# EAGLE design TPS54340 PS and Load Rev1 (EAGLE 9.3.0)
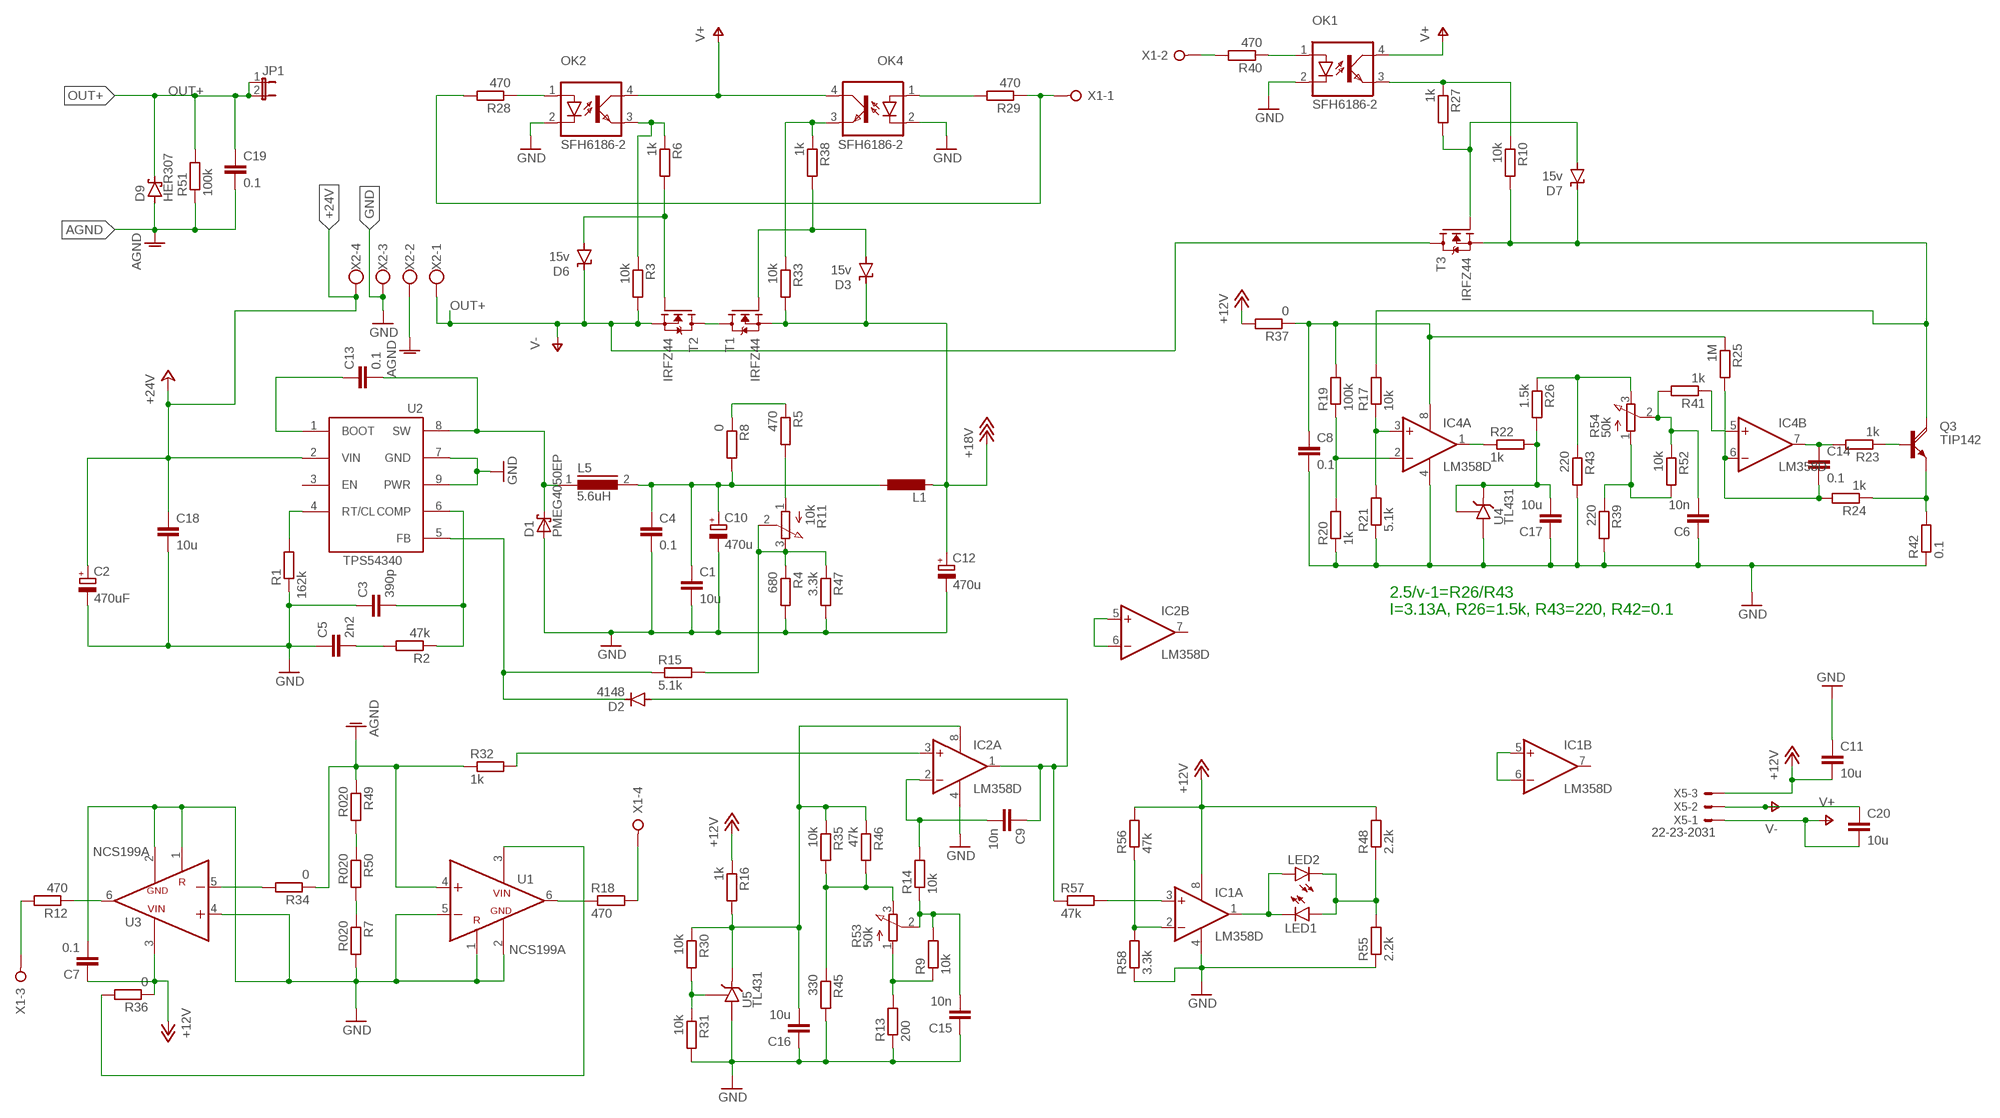
[diagram p0: schematic, sheet 1]

## Parts
C1  10u  C-EUC1210  [C1210]
C2  470uF  CPOL-EUE5-10.5  [E5-10,5]
C3  390p  C-EUC0603K  [C0603K]
C4  0.1  C-EUC1206  [C1206]
C5  2n2  C-EUC0603K  [C0603K]
C6  10n  C-EUC0603K  [C0603K]
C7  0.1  C-EUC0603K  [C0603K]
C8  0.1  C-EUC1206  [C1206]
C9  10n  C-EUC0603K  [C0603K]
C10  470u  CPOL-EUE5-10.5  [E5-10,5]
C11  10u  C-EUC1206  [C1206]
C12  470u  CPOL-EUE5-10.5  [E5-10,5]
C13  0.1  C-EU102-043X133  [C102-043X133]
C14  0.1  C-EUC1206  [C1206]
C15  10n  C-EUC0603K  [C0603K]
C16  10u  C-EUC0603K  [C0603K]
C17  10u  C-EUC0603K  [C0603K]
C18  10u  C-EUC1210  [C1210]
C19  0.1  C-EU150-054X183  [C150-054X183]
C20  10u  C-EUC1206  [C1206]
D1  PMEG4050EP  [SOD128]
D2  4148  PMLL41SOD80C  [SOD80C]
D3  15v  SUPPRESSOR-SMBJ  [SMBJ]
D6  15v  SUPPRESSOR-SMBJ  [SMBJ]
D7  15v  SUPPRESSOR-SMBJ  [SMBJ]
D9  HER307  15KEXX  [CB429-17]
IC1  LM358D  [SO08]
IC2  LM358D  [SO08]
IC4  LM358D  [SO08]
JP1  JP1E  [JP1]
L1  L-EU0207/5V  [0207/5V]
L5  5.6uH  DR125  [DR125]
LED1  LEDB152  [Q62902-B152]
LED2  LEDB152  [Q62902-B152]
OK1  SFH6186-2  [SMD4-7]
OK2  SFH6186-2  [SMD4-7]
OK4  SFH6186-2  [SMD4-7]
Q3  TIP142  [SOT93]
R1  162k  R-EU_R1206  [R1206]
R2  47k  R-EU_R0603  [R0603]
R3  10k  R-EU_R0603  [R0603]
R4  680  R-EU_R1206  [R1206]
R5  470  R-EU_R1206  [R1206]
R6  1k  R-EU_R0603  [R0603]
R7  R020  R-EU_R1206  [R1206]
R8  0  R-EU_R0603  [R0603]
R9  10k  R-EU_R0603  [R0603]
R10  10k  R-EU_R0603  [R0603]
R11  10k  3RP/1610N  [3RP/1610N]
R12  470  R-EU_R0603  [R0603]
R13  200  R-EU_R0603  [R0603]
R14  10k  R-EU_R1206  [R1206]
R15  5.1k  R-EU_R0603  [R0603]
R16  1k  R-EU_R0603  [R0603]
R17  10k  R-EU_R1206  [R1206]
R18  470  R-EU_R0603  [R0603]
R19  100k  R-EU_R1206  [R1206]
R20  1k  R-EU_R1206  [R1206]
R21  5.1k  R-EU_R1206  [R1206]
R22  1k  R-EU_R0603  [R0603]
R23  1k  R-EU_R1206  [R1206]
R24  1k  R-EU_R1206  [R1206]
R25  1M  R-EU_R1206  [R1206]
R26  1.5k  R-EU_R0603  [R0603]
R27  1k  R-EU_R0603  [R0603]
R28  470  R-EU_R0603  [R0603]
R29  470  R-EU_R0603  [R0603]
R30  10k  R-EU_R0603  [R0603]
R31  10k  R-EU_R0603  [R0603]
R32  1k  R-EU_R1206  [R1206]
R33  10k  R-EU_R0603  [R0603]
R34  0  R-EU_R1206  [R1206]
R35  10k  R-EU_R0603  [R0603]
R36  0  R-EU_R1206  [R1206]
R37  0  R-EU_R1206  [R1206]
R38  1k  R-EU_R0603  [R0603]
R39  220  R-EU_R0603  [R0603]
R40  470  R-EU_R0603  [R0603]
R41  1k  R-EU_R1206  [R1206]
R42  0.1  R-EU_0414/15  [0414/15]
R43  220  R-EU_R0603  [R0603]
R45  330  R-EU_R0603  [R0603]
R46  47k  R-EU_R0603  [R0603]
R47  3.3k  R-EU_R1206  [R1206]
R48  2.2k  R-EU_R0603  [R0603]
R49  R020  R-EU_R1206  [R1206]
R50  R020  R-EU_R1206  [R1206]
R51  100k  R-EU_0207/15  [0207/15]
R52  10k  R-EU_R0603  [R0603]
R53  50k  3RP/1610N  [3RP/1610N]
R54  50k  3RP/1610N  [3RP/1610N]
R55  2.2k  R-EU_R0603  [R0603]
R56  47k  R-EU_R0603  [R0603]
R57  47k  R-EU_R0603  [R0603]
R58  3.3k  R-EU_R0603  [R0603]
T1  IRFZ44  MOSFET-N-DPAK  [DPAK_TO252]
T2  IRFZ44  MOSFET-N-DPAK  [DPAK_TO252]
T3  IRFZ44  MOSFET-N-DPAK  [DPAK_TO252]
U1  NCS199A  [SOT363]
U2  TPS54340  TPS54340SO8  [HSOP]
U3  NCS199A  [SOT363]
U4  TL431  [SOT23]
U5  TL431  [SOT23]
X1  W237-04P  [W237-4P]
X2  W237-4  [W237-4]
X5  22-23-2031  [22-23-2031]

## Nets
+12V: C7.1 C11.2 IC1.8(P:V+) R16.1 R36.1 R37.2 R48.2 R56.2 U3.3(VCC) X5.3
+18V: C12.+ D3.C L1.2 R33.2 T1.3(S)
+24V: C2.+ C18.1 U2.2(VIN) X2.4
AGND: C19.2 D9.A R32.1 R34.1 R49.1 R51.1 U1.4(IN+) X2.2
GND: C1.2 C2.- C3.1 C4.2 C5.1 C6.1 C7.2 C8.2 C10.- C11.1 C12.- C15.1 C16.1 C17.1 C18.2 D1.2(A) IC1.4(P:V-) IC2.4(P:V-) IC4.4(P:V-) OK1.2(C) OK2.2(C) OK4.2(C) R1.1 R4.2 R7.2 R13.1 R20.1 R21.1 R31.2 R39.2 R42.1 R43.2 R45.2 R47.2 R55.1 R58.1 U1.1(REF) U1.2(GND) U1.5(IN-) U2.7(GND) U2.9(PWR) U3.1(REF) U3.2(GND) U3.4(IN+) U4.3(A) U5.3(A) X2.3
N$1: R1.2 U2.4(RT/CL)
N$2: C5.2 R2.2
N$3: C3.2 R2.1 U2.6(COMP)
N$4: R5.2 R11.1(A)
N$5: D6.A R6.2 T2.1(G)
N$6: IC2.3(A:+IN) R32.2
N$7: R4.1 R11.2(S) R11.3(E) R15.2 R47.1
N$8: C16.2 IC2.8(P:V+) R16.2 R30.1 R35.1 R46.1 U5.1(C)
N$10: OK2.3(EMIT) R3.1 R6.1
N$12: D3.A R38.2 T1.1(G)
N$13: C13.1 U2.1(BOOT)
N$14: C13.2 D1.1(K) L5.1 U2.8(SW)
N$15: R12.1 U3.6(OUT)
N$16: C9.2 IC2.2(A:-IN) R14.2
N$17: R30.2 R31.1 U5.2(R)
N$18: C9.1 D2.A IC2.1(A:OUT) R57.1
N$19: C15.2 R9.2 R14.1 R53.2(S)
N$20: R34.2 U3.5(IN-)
N$21: D2.C R15.1 U2.5(FB)
N$22: R18.1 U1.6(OUT)
N$23: T1.2(D) T2.2(D)
N$24: IC1.1(A:OUT) LED1.K(C) LED2.A
N$25: C1.1 C4.1 C10.+ L1.1 L5.2 R8.2
N$26: Q3.B R23.1
N$27: OK1.1(A) R40.1
N$28: C14.2 IC4.6(B:-IN) R24.2 R25.2
N$30: R26.1 R43.1 R54.3(E)
N$31: D7.C Q3.C R10.2 R17.2 T3.3(S)
N$32: OK1.3(EMIT) R10.1 R27.1
N$34: LED1.A LED2.K(C) R48.1 R55.2
N$35: R35.2 R45.1 R46.2 R53.3(E)
N$36: IC4.5(B:+IN) R41.1
N$37: IC1.2(A:-IN) R56.1 R58.2
N$38: R36.2 U1.3(VCC)
N$39: R18.2 X1.4
N$40: R12.2 X1.3
N$41: D7.A R27.2 T3.1(G)
N$42: R39.1 R52.2 R54.1(A)
N$43: C8.1 IC4.8(P:V+) R19.2 R25.1 R37.1
N$44: R40.2 X1.2
N$45: R9.1 R13.2 R53.1(A)
N$46: R49.2 R50.1
N$47: IC2.5(B:+IN) IC2.6(B:-IN)
N$48: IC1.3(A:+IN) R57.2
N$49: IC1.5(B:+IN) IC1.6(B:-IN)
N$52: R7.1 R50.2
N$61: OK4.3(EMIT) R33.1 R38.1
N$62: OK4.1(A) R29.2
N$63: R28.2 R29.1 X1.1
N$64: OK2.1(A) R28.1
N$65: C17.2 R22.2 R26.2 U4.1(C) U4.2(R)
N$66: R5.1 R8.1
N$106: Q3.E R24.1 R42.2
N$289: C14.1 IC4.7(B:OUT) R23.2
N$290: C6.2 R41.2 R52.1 R54.2(S)
N$291: IC4.1(A:OUT) R22.1
N$292: IC4.3(A:+IN) R17.1 R21.2
N$294: IC4.2(A:-IN) R19.1 R20.2
OUT+: C19.1 C20.1 D6.C D9.C JP1.1 JP1.2 R3.2 R51.2 T2.3(S) T3.2(D) X2.1 X5.2 ; supply symbol labelled V-
V+: C20.2 OK1.4(COL) OK2.4(COL) OK4.4(COL) X5.1
Unconnected: IC1.7(B:OUT) IC2.7(B:OUT) U2.3(EN)

## Notes on the sheet
- 2.5/v-1=R26/R43
  I=3.13A, R26=1.5k, R43=220, R42=0.1

## Library data of the parts
C1 C3 C5-C7 C9 C13 C15-C19 = rcl:C-EU: CAPACITOR, European symbol; SPICEPREFIX: C
C2 C10 C12 = rcl:CPOL-EU: POLARIZED CAPACITOR, European symbol; SPICEPREFIX: C
C4 C8 C11 C14 C20 = rcl:C-EU: CAPACITOR, European symbol
D1 = NXP_60_26022015:PMEG4050E: 40 V, 5 A low VF MEGA Schottky barrier rectifier Planar Maximum Efficiency General Application (MEGA) Schottky barrier rectifier with an integrated guard ring for stress protection. AAL Eindhoven MK
D2 = diode:PMLL41*: High-speed diodes Source: http://www.semiconductors.philips.com/acrobat_download/datasheets/PMLL4150_2.pdf
D3 D6 D7 = diode:SUPPRESSOR-: Suppressor diode
D9 = diode:15KEXX: DIODE
IC1 IC2 IC4 = linear:LM358: OP AMP also LM158; LM258; LM2904 Source: http://cache.national.com/ds/LM/LM158.pdf
JP1 = jumper:JP1E: JUMPER
L1 = rcl:L-EU: INDUCTOR, European symbol; SPICEPREFIX: L
L5 = inductors:DR125: High Power Density, High Efficiency, Shielded Inductors Source: coiltronics_dr_series.pdf; SPICEPREFIX: L
LED1 LED2 = led:LED: LED OSRAM: - CHIPLED LG R971, LG N971, LY N971, LG Q971, LY Q971, LO R971, LY R971 LH N974, LH R974 LS Q976, LO Q976, LY Q976 LO Q996 - Hyper CHIPLED LW Q18S LB Q993, LB Q99A, LB R99A - SideLED LS A670, LO A670, LY A670, LG A670, LP A670 LB A673, LV A673, LT A673, LW A673 LH A674 LY A675 LS A676, LA A676, LO A676, LY A676, LW A676 LS A679, LY A679, LG A679 - Hyper Micro SIDELED® LS Y876, LA Y876, LO Y876, LY Y876 LT Y87S - SmartLED LW L88C, LW L88S LB L89C, LB L89S, LG L890 LS L89K, LO L89K, LY L89K LS L896, LA L896, LO L896, LY L896 - TOPLED LS T670, LO T670, LY T670, LG T670, LP T670 LSG T670, LSP T670, LSY T670, LOP T670, LYG T670 LG T671, LOG T671, LSG T671 LB T673, LV T673, LT T673, LW T673 LH T674 LS T676, LA T676, LO T676, LY T676, LB T676, LH T676, LSB T676, LW T676 LB T67C, LV T67C, LT T67C, LS T67K, LO T67K, LY T67K, LW E67C LS E67B, LA E67B, LO E67B, LY E67B, LB E67C, LV E67C, LT E67C LW T67C LS T679, LY T679, LG T679 LS T770, LO T770, LY T770, LG T770, LP T770 LB T773, LV T773, LT T773, LW T773 LH T774 LS E675, LA E675, LY E675, LS T675 LS T776, LA T776, LO T776, LY T776, LB T776 LHGB T686 LT T68C, LB T68C - Hyper Mini TOPLED® LB M676 - Mini TOPLED Santana® LG M470 LS M47K, LO M47K, LY M47K Source: http://www.osram.convergy.de LUXEON: - LUMILED® LXK2-PW12-R00, LXK2-PW12-S00, LXK2-PW14-U00, LXK2-PW14-V00 LXK2-PM12-R00, LXK2-PM12-S00, LXK2-PM14-U00 LXK2-PE12-Q00, LXK2-PE12-R00, LXK2-PE12-S00, LXK2-PE14-T00, LXK2-PE14-U00 LXK2-PB12-K00, LXK2-PB12-L00, LXK2-PB12-M00, LXK2-PB14-N00, LXK2-PB14-P00, LXK2-PB14-Q00 LXK2-PR12-L00, LXK2-PR12-M00, LXK2-PR14-Q00, LXK2-PR14-R00 LXK2-PD12-Q00, LXK2-PD12-R00, LXK2-PD12-S00 LXK2-PH12-R00, LXK2-PH12-S00 LXK2-PL12-P00, LXK2-PL12-Q00, LXK2-PL12-R00 Source: www.luxeon.com KINGBRIGHT: KA-3528ASYC Source: www.kingbright.com
OK1 OK2 OK4 = optocoupler:SFH618?*: Optocoupler, Phototransistor Output, Low Input Current Source: Data sheet <http://www.vishay.com/docs/83673/sfh618.pdf>; MF: VISHAY/TELEFUNKEN; MPN: SFH6186-2; OC_FARNELL: 1469583; OC_NEWARK: 58K2210
Q3 = transistor-power:TIP142: NPN DARLINGTON TRANSISTOR
R1 R4 R5 R7 R14 R17 R19-R21 R23-R25 R32 R34 R36 R37 R41 R47 R49 R50 = rcl:R-EU_: RESISTOR, European symbol
R2 R3 R6 R8-R10 R12 R13 R15 R16 R18 R22 R26-R31 R33 R35 R38-R40 R42 R43 R45 R46 R48 R51 R52 R55-R58 = rcl:R-EU_: RESISTOR, European symbol; SPICEPREFIX: R
R11 R53 R54 = pot:3RP/1610N: 16mm Potentiometer one level Source: http://www.alphapotentiometers.net/html/16mm_pot_2.html
T1-T3 = we-transistor:MOSFET-N: N-Channel MOSFET SOT23 N-Chn MOSFET TSM3404, IRLML2502 (Vgs>=+/-20V, Vds<=20V, Id>=3A + Rds<=0.05Ohm @ Vgs=4.5V) BSS138 (Vgs>=+/-20V, Vds<=40V, Id>=0.2A + Rds<=3Ohm @ Vgs=4.5V) SOT223 Low Side Switch with Protection (Infineon) BSP76 (Vin=0...10V, Vds<=42V, Id=1.4A + Rds=0.2Ohm @ Vin=5V) BSP77 (Vin=0...10V, Vds<=42V, Id=2.2A + Rds=0.1Ohm @ Vin=5V) D²Pak Low Side Switch with Protection (Infineon) BTS117TC (Vin=0...10V, Vds<=60V, Id=3.5A + Rds=0.12Ohm @ Vin=5V) BTS133TC (Vin=0...10V, Vds<=60V, Id=7A + Rds=0.06Ohm @ Vin=5V) BTS141TC (Vin=0...10V, Vds<=60V, Id=12A + Rds=0.03Ohm @ Vin=5V) BTS3018TC (Vin=0...10V, Vds<=60V, Id=6A + Rds=0.02Ohm @ Vin=5V)
U1 U3 = ProjectLibrary:NCS199A: NCS199A Current-Shunt Monitor, Voltage Output, Bi-Directional Zero-Drift The LNA is housed in a 6-pin SOT363 plastic SMD package.
U2 = ProjectLibrary:TPS54340: TPS54340 42 V Input, 3.5 A, Step Down DC-DC Converter with Eco-mode™
U4 U5 = 1my:TL431
X1 = con-wago-508:W237-04P: WAGO SREW CLAMP; OC_FARNELL: unknown; OC_NEWARK: unknown
X2 = con-wago-500:W237-4: WAGO SCREW CLAMP; OC_FARNELL: unknown; OC_NEWARK: unknown
X5 = con-molex:22-23-2031: .100" (2.54mm) Center Header - 3 Pin; MF: MOLEX; MPN: 22-23-2031; OC_FARNELL: 1462950; OC_NEWARK: 30C0862

## Board
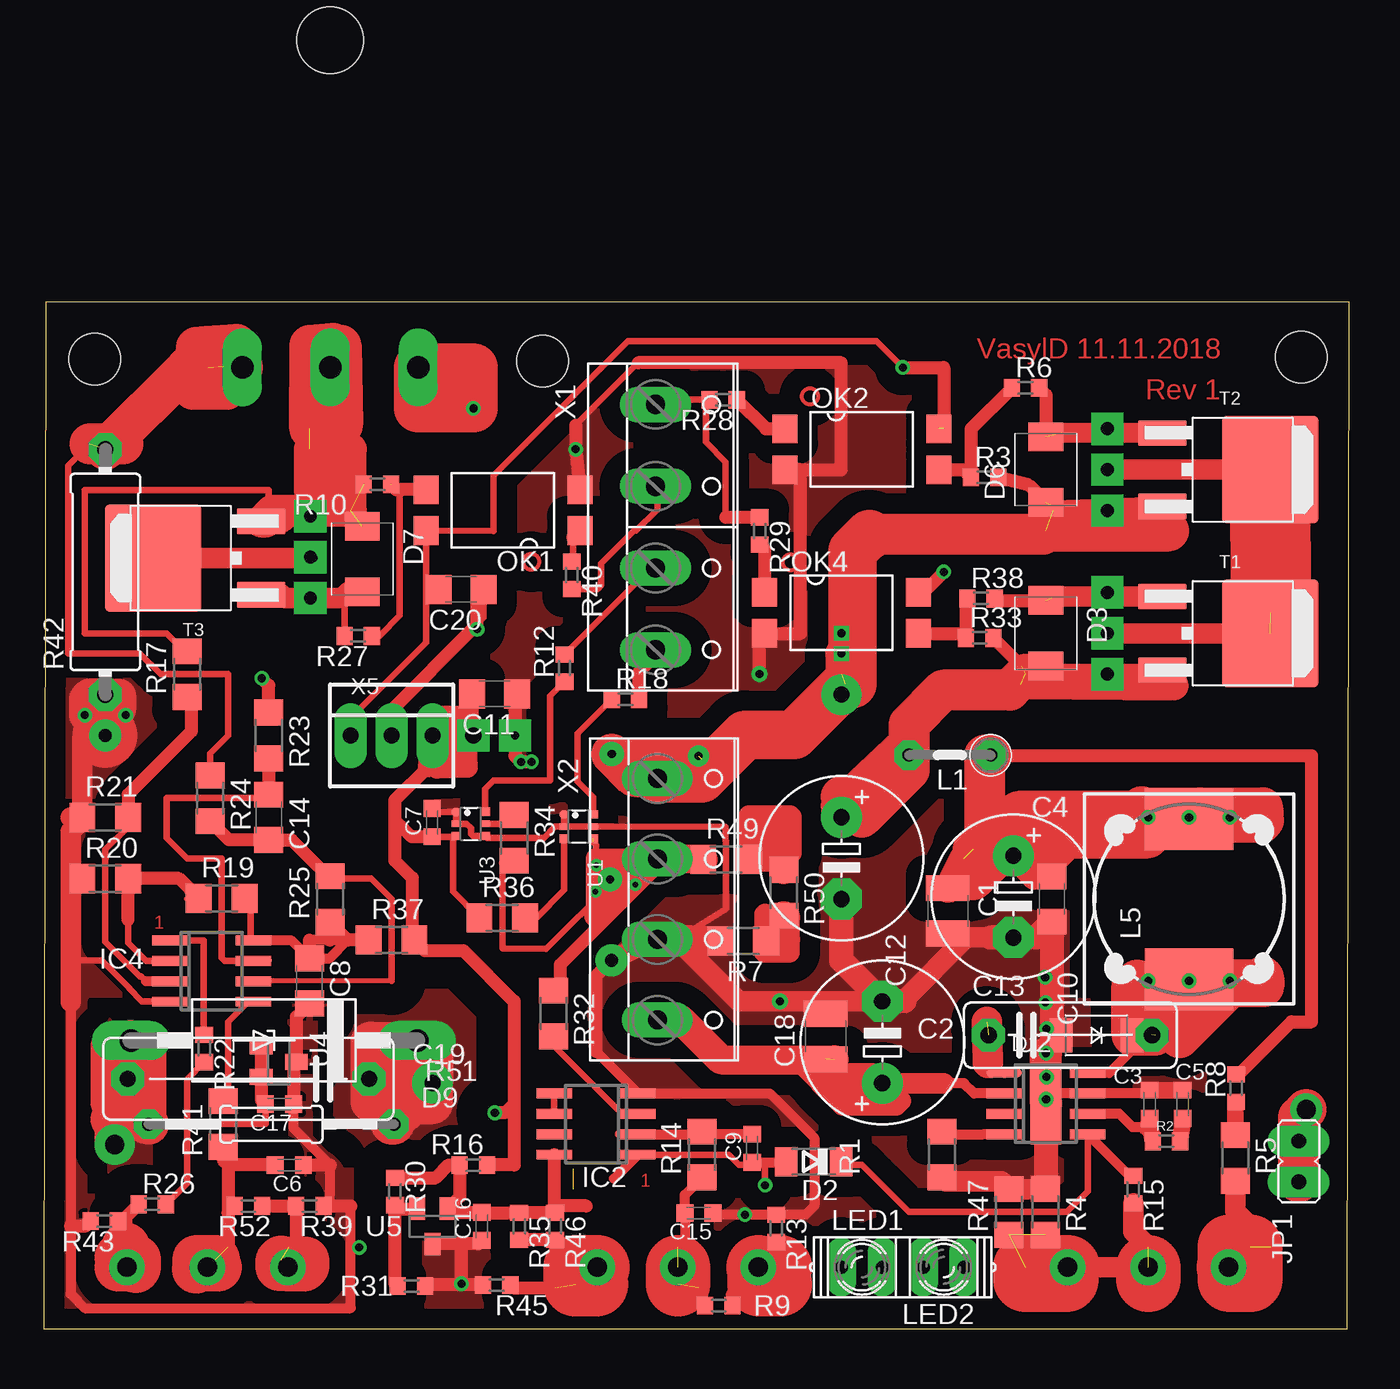
[diagram p1: board, top side]
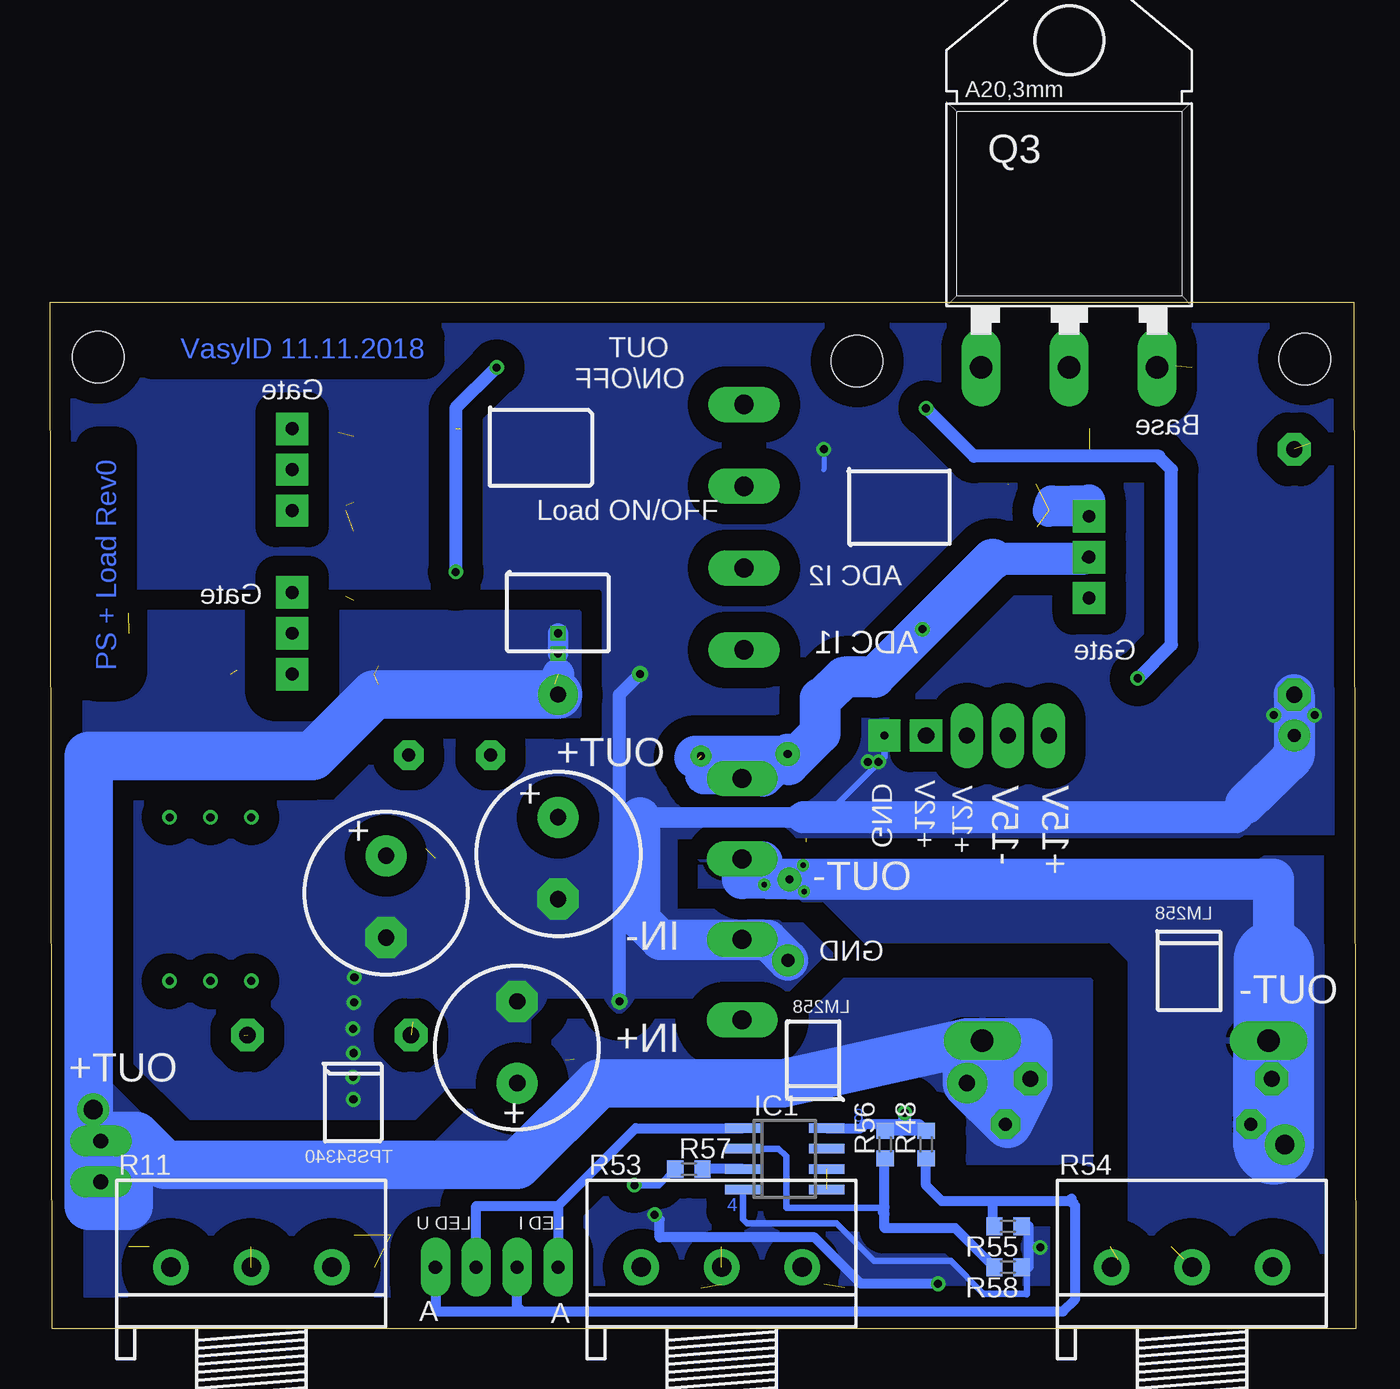
[diagram p2: board, bottom side, seen from below]

Size 81.08 x 63.76 mm. Coordinates in mm from the lower left corner, seen from the top.
Outline: 0,0 80.95,0 81.08,63.76 0.13,63.76 0,0
Copper layers (1*16): Top 0.035mm / dielectric 1.5mm / Bottom 0.035mm
Design rules "Charger for battery (TPS54340) power *": minimum track width 12mil, minimum drill 0.5mm, track to track 22mil, track to pad 16mil, pad to pad 20mil, via to via 20mil, smd to smd 6mil, copper to edge 30mil, drill to drill 6mil, minimum pad ring 20mil, minimum via ring 8mil, stop-mask expansion 4mil, vias tented up to drill 0mil, thermal gap 10mil
Holes 3.2 mm at 3.16,60.21 78.09,60.33 30.96,60.08

### Footprints (pad centres in the part's own frame; a part is rotated, then mirrored left to right if it is on the bottom)
C1210 = smd 1.6 x 2.7: 1 -1.4,0; 2 1.4,0
E5-10,5 = drill 1.016 pad 2.54: + -2.54,0 | drill 1.016 pad 2.54 octagon: - 2.54,0
C0603K = smd 1.05 x 1.08: 1 -0.875,0; 2 0.875,0
C1206 = smd 1.6 x 1.8: 1 -1.4,0; 2 1.4,0
C102-043X133 = drill 1.016 octagon: 1 -5.08,0; 2 5.08,0
C150-054X183 = drill 1.016 octagon: 1 -7.493,0; 2 7.493,0
SOD128 = smd 1.4 x 2.1: 1 -2.2,0; 2 2.2,0
SOD80C = smd 1.4 x 1.8: A 1.7,0; C -1.7,0
SMBJ = smd 1.78 x 2.16: A 2.04,0; C -2.03,0
CB429-17 = drill 1.397 long: A 8.89,0; C -8.89,0
SO08 = smd 0.6 x 2.2: 1 -1.905,-2.6; 2 -0.635,-2.6; 3 0.635,-2.6; 4 1.905,-2.6; 5 1.905,2.6; 6 0.635,2.6; 7 -0.635,2.6; 8 -1.905,2.6
JP1 = drill 0.914 long: 1 0,-1.27; 2 0,1.27
0207/5V = drill 0.813 octagon: 1 -2.54,0; 2 2.54,0
DR125 = smd 3.85 x 5.5: 1 -4.975,0; 2 4.975,0
Q62902-B152 = drill 0.813 long: A 1.27,0; K -1.27,0
SMD4-7 = smd 1.78 x 1.55: 1 -1.27,-4.77; 2 1.27,-4.77; 3 1.27,4.77; 4 -1.27,4.77
SOT93 = drill 1.397 long: B -5.461,-10.16; C 0,-10.16; E 5.461,-10.16 | hole 4.115: 0,10.16
R1206 = smd 1.6 x 1.803: 1 -1.422,0; 2 1.422,0
R0603 = smd 1 x 1.1: 1 -0.85,0; 2 0.85,0
3RP/1610N = drill 1.2 pad 2.184: 1 -5,0; 2 0,0; 3 5,0
0414/15 = drill 1.016 octagon: 1 -7.62,0; 2 7.62,0
0207/15 = drill 0.813 octagon: 1 -7.62,0; 2 7.62,0
DPAK_TO252 = smd 3 x 1.6: 1 -4.2,2.28; 3 -4.2,-2.28 | smd 6 x 6.7: 2 2.5,0
SOT363 = smd 0.524 x 0.6: 1 -0.75,-0.9; 3 0.75,-0.9; 4 0.75,0.9; 6 -0.75,0.9 | smd 0.4 x 0.6: 2 0,-0.9; 5 0,0.9
HSOP = smd 0.6 x 2.2: 1 -1.905,-2.6; 2 -0.635,-2.6; 3 0.635,-2.6; 4 1.905,-2.6; 5 1.905,2.6; 6 0.635,2.6; 7 -0.635,2.6; 8 -1.905,2.6 | smd 5.08 x 1.905: 9 0,0
SOT23 = smd 1 x 1.4: 1 -0.95,-1.1; 2 0.95,-1.1; 3 0,1.1
W237-4P = drill 1.194 long: 1 -7.62,-0.635; 2 -2.54,-0.635; 3 2.54,-0.635; 4 7.62,-0.635
W237-4 = drill 1.194 long: 1 -7.5,-1.27; 2 -2.5,-1.27; 3 2.5,-1.27; 4 7.5,-1.27
22-23-2031 = drill 1 long: 1 -2.54,0; 2 0,0; 3 2.54,0

### Placement (x,y rotation side)
C1  56.13,25.95 270 top
C2  52.07,17.78 90 top
C3  68.67,13.93 270 top
C4  62.6,26.67 270 top
C5  70.71,13.93 270 top
C6  15.24,10.16 180 top
C7  24.1,31.42 90 top
C8  16.5,21.59 270 top
C9  43.98,11.2 90 top
C10  60.21,26.82 270 top
C11  27.99,39.42 180 top
C12  49.53,29.21 270 top
C13  63.74,18.22 0 top
C14  13.97,31.75 270 top
C15  40.68,7.18 180 top
C16  27.19,6.35 90 top
C17  14.63,13.93 180 top
C18  48.55,18.14 90 top
C19  12.7,15.51 180 top
C20  25.91,45.91 180 top
D1  65.37,18.21 180 top
D2  47.8,10.36 180 top
D3  62.23,43.18 90 top
D6  62.23,53.34 90 top
D7  19.77,47.79 270 top
D9  14.29,17.89 180 top
IC1  35.46,10.54 270 bottom
IC2  34.29,12.7 90 top
IC4  10.41,22.2 270 top
JP1  77.93,10.38 0 top
L1  56.26,35.61 180 top
L5  71.12,26.67 90 top
LED1  50.8,3.81 0 top
LED2  55.88,3.81 180 top
OK1  28.51,50.83 90 top
OK2  50.8,54.61 270 top
OK4  49.53,44.45 270 top
Q3  17.78,69.85 0 bottom
R1  55.77,10.81 90 top
R2  69.71,11.63 0 top
R3  58.42,52.86 0 top
R4  62.2,7.25 90 top
R5  73.99,10.59 270 top
R6  60.96,58.42 0 top
R7  43.42,24.08 180 top
R8  74.04,14.94 90 top
R9  41.91,1.42 180 top
R10  20.71,52.44 180 top
R11  68.58,3.81 0 bottom
R12  32.33,41.02 90 top
R13  45.48,6.22 270 top
R14  40.87,10.81 90 top
R15  67.65,8.64 270 top
R16  26.67,10.16 180 top
R17  8.89,40.64 90 top
R18  36.12,39.09 0 top
R19  11.04,26.72 0 top
R20  3.81,27.94 0 top
R21  3.81,31.75 0 top
R22  9.96,17.4 270 top
R23  13.97,36.83 270 top
R24  10.33,32.93 270 top
R25  17.78,26.67 90 top
R26  6.73,7.72 0 top
R27  19.52,43.01 180 top
R28  42.18,57.68 180 top
R29  44.45,49.53 270 top
R30  21.81,8.52 270 top
R31  22.82,2.64 0 top
R32  31.65,19.57 270 top
R33  58.12,42.89 0 top
R34  29.21,30.48 90 top
R35  29.51,6.35 270 top
R36  28.46,25.5 0 top
R37  21.59,24.13 0 top
R38  58.19,45.34 0 top
R39  16.51,7.62 0 top
R40  32.78,46.79 270 top
R41  11.14,12.7 270 top
R42  3.81,46.99 90 top
R43  3.75,6.67 180 top
R45  28.12,2.71 180 top
R46  31.75,6.35 270 top
R47  59.93,7.24 90 top
R48  26.67,11.43 90 bottom
R49  42.37,29.13 0 top
R50  45.95,27.06 270 top
R51  14.12,12.69 0 top
R52  12.7,7.62 0 top
R53  39.37,3.81 0 bottom
R54  10.16,3.81 0 bottom
R55  21.59,6.35 180 bottom
R56  29.21,11.43 90 bottom
R57  41.4,9.91 0 bottom
R58  21.59,3.81 180 bottom
T1  73.66,43.18 0 top
T2  73.66,53.34 0 top
T3  9.28,47.85 180 top
U1  33.21,31.18 270 top
U2  62.23,13.97 270 top
U3  26.5,31.34 270 top
U4  14.59,16.57 270 top
U5  24.13,6.35 180 top
X1  38.62,49.77 270 top
X2  39.37,26.67 270 top
X5  21.59,36.83 0 top

### Tracks (layer width: path | path; a pad name or v marks a point on that pad's centre or on a via)
+12V  (via drill 0.5, 1 pad 2)
  Top 0.406: R36.1 25.4,27.14 25.4,30.39 U3.3 25.56,30.55 C7.1
  Top 0.813: C7.1 22.84,30.55 21.79,31.59 | 21.79,31.59 21.79,32.82 23.84,34.87 | 21.79,31.59 21.79,29.07 22.87,27.99 22.87,24.27 R37.2 23.67,23.47 26.06,23.47 29.21,20.32 29.21,13.97 | 29.21,13.97 29.21,10.16 R16.1 | 29.21,13.97 28.64,13.4 v28,13.4 | C11.2 26.59,36.46 26.26,36.13
  Top 1.27: v26.67,36.83 X5.3 24.41,34.8 26.31,34.85 26.26,36.13 26.18,38.04 24.8,38.04 25.39,35.71 23.95,35.59 23.84,34.87
  Bottom 0.61: R56.2 R48.2 27.09,12.7 27.94,12.7 30.48,12.7 30.73,12.45 IC1.8
  Bottom 0.813: v28,13.4 28,12.76 27.94,12.7
+18V  (3 unrouted)
  Top 0.813: R33.2 60.7,41.15 D3.C
  Top 1.27: 69.85,40.64 60.96,40.64
  Top 1.8: 50.8,31.75 49.92,32.14 49.14,32.49 53.3,36.42 | 60.67,39.99 70.18,39.92
  Top 2.54: 50.8,31.75 53.72,34.67 L1.2 53.72,37.53 55.84,39.65 59.97,39.65 60.96,40.64 | 49.92,32.14 C12.+ 49.53,33.02
+24V  (1 unrouted)
  Top 0.61: U2.2 57.78,14.61 57.15,15.24 55.88,15.24
  Top 1.27: 39.37,19.05 38.22,19.05 X2.4 39.55,19.17 | 46.99,16.51 48.26,15.24 48.26,15.18 49.58,13.86 52.95,13.86 53.24,14.15 53.16,14.15 C2.+ | 55.88,15.24 C2.+ | C18.1 48.55,16.59 50.35,14.78 50.81,15.24 C2.+ | C2.+ 51.46,15.85 50.11,15.85
  Top 1.8: 39.55,19.17 42.04,16.69 49.07,16.69
AGND  (via drill 0.35, 0.5 pad 1.5, 1.2 pad 2.5)  (1 unrouted)
  Top 0.406: 34.11,30.21 34.29,30.03 34.29,29.21 X2.2 37.17,28.72 | 37.17,28.88 v35.15,27.9 35.12,27.86 | 35.3,27.68 31.2,23.58 28.47,23.6 28.47,28.89 28.46,28.91 R34.1
  Top 0.813: R32.1 32.08,21.42 32.08,22.61 37.97,28.5 37.97,29.16 37.97,29.73
  Top 1.27: 37.97,29.16 34.34,29.16 34.29,29.21 34.29,25.69 | 34.29,25.69 34.2,25.6 | 34.29,25.69 37.17,28.57 37.17,28.72 37.17,28.88 | X2.2 37.42,28.49 35.05,28.49 35.05,27.93 35.12,27.86 35.3,27.68
  Top 1.7: 38.1,29.21 X2.2
  Top 1.8: 38,29.13 37.97,29.16 | R49.1 38.1,29.21
  Top 2.5: 5.08,17.78 5.28,17.78 D9.A 5.21,17.7 C19.2 | R51.1 6.35,12.7 6.35,17.78 4.42,17.78 4.15,17.51 4.15,14.05 4.88,13.32 4.53,12.98 4.15,12.98 | 5.08,13.97 4.39,13.28 v4.39,11.42
  Top 4: 5.08,13.97 5.21,14.1 C19.2
  Bottom 2.5: v4.39,11.42 4.39,17.09 5.08,17.78 6.35,17.78 6.35,11.43 5.08,11.43
  Bottom 2.54: 5.08,22.86 5.08,27.9 v35.15,27.9 38.1,27.94 36.85,28.98
  Bottom 5: 5.08,11.43 5.08,22.86
  other vias: 34.32,28.78 36.73,27.57 34.25,27.14
  pour Top (isolate 1.93, no thermals): 2.54,21.59 6.35,21.59 8.89,19.05 8.89,10.16 6.35,7.62 2.54,7.62
  pour Bottom (isolate 1.93): 0,29.21 40.64,29.21 40.64,26.67 33.02,26.67 30.48,24.13 15.24,24.13 13.97,22.86 13.97,0 0,0
GND  (via drill 0.5, 0.5 pad 0.7, 0.5 pad 1, 0.5 pad 2, 0.8 pad 2)
  Top 0.406: U1.2 U1.5 35.31,31.18 42.34,31.15 42.34,30.3 42.35,30.29 42.35,30.07 | U1.1 U1.2 | U1.2 31.75,31.18 31.05,30.48 27.52,30.48 U3.4 26.64,30.59 26.52,30.72 26.52,31.09 26.26,31.34 U3.2 U3.1 24.31,32.09 C7.2 | 2.54,27.79 R20.1 1.65,28.68 1.65,30.48 | 42.35,30.07 42.37,30.06 | 42.35,30.07 42.35,27.98 42.35,26.05 39.33,24.17 | 36.91,59.98 33.02,56.1 | IC4.4 7.79,20.32 6.09,20.32 5.28,21.12 5.28,21.17 3.6,22.86 1.65,22.86
  Top 0.61: C3.1 68.22,14.61 U2.7 62.87,14.61 U2.9 | 1.65,20.3 1.65,6.35 1.65,2.16 2.54,1.27 19.05,1.27 19.05,5.08 | 19.05,5.08 19.05,7.62 | 17.78,7.62 17.78,10.16 15.51,12.44 C17.1 | C8.2 16.03,19.72 16.03,19.7 | 34.29,17.2 IC2.4 45.09,14.61 47.85,11.84 47.85,7.62 47.31,7.07 R13.1 v43.53,7.07 | v43.53,7.07 41.66,7.07 C15.1 | v43.54,7.08 v43.53,7.07 | v19.58,5.04 19.09,5.04 19.05,5.08
  Top 0.813: C5.1 70.65,14.87 68.85,14.87 | 27.27,5.4 C16.1 26.97,5.25 25.93,5.25 | R45.2 25.93,2.71 | 25.93,2.71 23.73,2.71 R31.2 | 34.29,17.2 34.29,21.89 v35.26,22.86 | 46.99,53.34 OK2.2 | 46.99,53.34 46.99,43.18 OK4.2 44.45,42.87 v44.45,40.64 | 46.99,53.34 49.53,53.34 49.53,59.98 36.91,59.98 | OK1.2 v33.02,54.61 33.02,56.1 | R43.2 2.58,6.35 1.65,6.35 | C17.1 15.51,16.39 U4.3 15.69,19.36 16.03,19.7 | R39.2 17.78,7.62 19.05,7.62 | C6.1 17.78,10.16 | 25.93,5.25 U5.3 | 25.93,5.25 v25.93,2.78 25.93,2.71 | v30.28,35.2 v29.62,35.2 29.26,35.56 v29.26,36.83 29.26,39.29 C11.1
  Top 1.016: C3.1 C5.1 70.73,14.81
  Top 1.27: R21.1 2.39,31.6 1.65,30.86 1.65,30.48 1.65,22.86 1.65,20.3 | R21.1 1.65,31.75 | R1.1 56.01,9.14 59.45,9.14 R47.2 R4.2 | 39.33,24.17 43.18,20.32 v45.72,20.32 C2.- 53.34,20.32 57.3,24.28 C10.- | X2.3 37.8,24.17 v35.26,22.86 | R21.1 2.39,36.68 2.54,36.83
  Top 1.5: U2.9 62.23,8.89 | v62.23,17.11 62.6,17.48 C4.2 61.61,24.28 C10.- 58.81,24.28 | 53.47,20.32 C2.- 49.53,22.86 C12.-
  Top 1.8: R7.2 41.99,24.09 39.33,24.17 X2.3
  Top 2: U2.9 v62.23,17.11 | v2.54,38.1 2.54,39.12 2.79,39.37 R42.1 4.67,39.37 4.72,39.32 4.72,38.42 4.39,38.09
  Top 4: 3.77,36.87 v3.81,36.83
  Bottom 0.305: v33.02,54.61 33.02,53.34
  Bottom 0.406: IC1.4 38.06,6.79 37.8,6.53 32.24,6.53 29.92,4.2 25.15,4.2 23.1,2.16 20.46,2.16 20.43,2.13 20.41,2.13 20.41,3.48 R58.1 | 33.02,31.75 29.26,35.51 v29.26,36.83
  Bottom 0.61: v25.93,2.78 30.72,2.78 33.59,5.65 43.22,5.65 43.22,6.76 v43.54,7.08 | R55.1 20.32,6.35 20.32,5.08 | 20.32,5.08 20.32,3.81 R58.1 | 20.32,5.08 19.62,5.08 v19.58,5.04
  Bottom 0.813: v45.72,20.32 45.72,39.37 v44.45,40.64
  Bottom 1.27: 7.44,31.75 6.83,32.6 4.41,35.99 v3.81,36.83 | 34.29,31.75 44.45,31.75
  Bottom 2: 6.47,33.11 7.44,31.75 33.02,31.75 34.29,31.75
  Bottom 2.5: v35.26,22.86 36.52,24.13 43.18,24.13 44.45,25.4 44.45,31.75
  Bottom 2.54: R42.1 3.81,35.56 6.83,32.6
  other vias: 62.24,14.24 62.27,15.62 62.27,18.62 62.2,20.24 62.18,21.82 5.08,38.1
  pour Top (isolate 1.27, rank 5, no thermals): 80.01,0 21.59,0 21.59,41.91 0,41.91 0,63.5 81.28,63.5 81.28,36.83 63.5,36.83 63.5,20.32 80.01,20.32
  pour Top (isolate 1.27, rank 4): 1.27,0 19.05,0 19.05,40.64 0,40.64 0,0
  pour Bottom (isolate 1.27, rank 2, no thermals): 0,63.5 81.28,63.5 81.28,0 0,0
N$1
  Top 0.61: U2.4 58.28,12.05 55.95,12.05 R1.2
N$2
  Top 1.016: C5.2 70.7,12.62 R2.2
N$3
  Top 0.61: U2.6 66.78,13.34 67.61,12.5 68.45,12.5 C3.2
  Top 1.016: R2.1 68.67,12.64 68.52,12.52 68.45,12.5
N$4  (1 unrouted)
  Top 1.27: R5.2 73.99,7.29 76.2,5.08
  Top 4: R11.1 73.66,3.89 73.66,5.08 74.93,5.08 74.93,3.02 73.66,3.02
N$5  (1 unrouted)
  Top 0.813: R6.2 62.23,58 D6.A
  Top 1.27: T2.1 63.2,55.65
N$6
  Top 0.406: R32.2 31.65,17.58 35.9,13.34 IC2.3
N$7  (3 unrouted)
  Top 1.27: R15.2 67.65,6.01 68.58,5.08 | 63.5,3.02 64.29,3.81 R11.2
  Top 4: R11.3 60.96,3.81 60.96,3.02 63.5,3.02 | R11.2 68.58,3.02
N$8
  Top 0.813: IC2.8 31.69,7.62 | 31.69,7.62 31.69,7.26 R46.1 R35.1 27.22,7.2 C16.2 25.3,7.22 U5.1 25.82,8.19 R16.2 25.13,10.16 24.35,9.37 R30.1 | 33.67,7.62 31.69,7.62
N$9  (via drill 0.8 pad 2)
  other vias: 16.55,45.36
N$10
  Top 0.813: R6.1 57.57,55.88 R3.1 57.09,53.34 OK2.3
N$11  (via drill 0.5)
  other vias: 73.66,31.75
N$12  (1 unrouted)
  Top 0.813: R38.2 59.16,45.22 D3.A
  Top 1.27: T1.1 63.04,45.45 62.73,45.45
N$13  (1 unrouted)
  Top 0.61: U2.1 58.84,15.88 58.53,16.18 58.61,16.5
  Top 1.9: 58.61,16.5 58.57,19.05
N$14  (via drill 0.5)  (1 unrouted)
  Top 0.61: U2.8 66.17,15.88 67.57,17.27 D1.1
  Top 2.54: 70.52,19.72 71.12,20.32 v71.12,21.59 | 70.52,19.72 69.01,18.21 D1.1 67.57,21.31 67.89,21.64 | L5.1 75.53,21.7 75.69,21.86 75.75,21.79 75.75,21.22 73.69,21.22 70.52,18.06 70.52,19.72
N$15
  Top 0.406: U3.6 27.41,33.5 27.94,34.04 31.45,34.04 31.45,39.28 R12.1
N$16
  Top 0.61: 43.79,11.89 C9.2 40.72,12.08 | 35.75,12.06 IC2.2 40.56,12.06 40.58,12.08 40.72,12.08 | 40.72,12.08 R14.2
N$17
  Top 0.813: U5.2 22.03,7.45 R30.2 21.81,2.81 R31.1
N$18  (via drill 0.5)
  Top 0.406: IC2.1 42.55,10.79 43.18,10.16 43.81,10.16 C9.1 | 44.45,10.33 44.79,9.98 v44.79,8.9
  Top 0.61: C9.1 44.45,10.33 46.07,10.33 D2.A | IC2.1 35.39,9.3
  Bottom 0.406: v44.79,8.9 43.26,8.9 R57.1
N$19  (2 unrouted)
  Top 0.61: R14.1 39.8,8.32 C15.2 39.8,5.51 39.37,5.08
  Top 0.813: R9.2 40.64,1.84 40.64,2.54
  Top 4: R53.2 39.37,2.76
N$20
  Top 0.406: U3.5 28.8,31.34 29.21,31.75 R34.2
N$21
  Top 0.406: U2.5 64.83,8.53 63.54,7.24 53.72,7.24 50.8,10.16 49.71,10.16 D2.C
  Top 0.61: U2.5 67.41,9.49 R15.1
N$22
  Top 0.406: U1.6 34.11,33.01 33.15,33.97 33.15,36.97 R18.1
N$23  (1 unrouted)
  Top 1.27: T1.2 66.04,43.18 | T2.2 66.04,53.34
  Top 5: T2.2 76.2,44.45
N$24
  Bottom 0.61: LED2.A 54.61,7.62 49.53,7.62 | 49.53,7.62 LED1.K | 49.53,7.62 44.7,12.45 IC1.1
N$25  (via drill 0.5)  (1 unrouted)
  Top 0.813: R8.2 74.2,15.79 77.47,19.05 78.74,19.05 78.74,35.56 58.8,35.56 L1.1 58.8,30.86
  Top 1.6: 62.6,29.58 C4.1 61.5,28.07 C10.+ | 62.23,29.21 62.38,29.36 64.77,31.75 v68.58,31.75 71.02,31.75
  Top 1.8: C1.1 56.23,27.37 57.15,29.21
  Top 2.54: 71.02,31.75 L5.2 71.81,32.33 75.69,32.33 75.69,31.62 75.75,31.56 75.62,31.42 72.95,31.42 | 58.42,30.48 58.8,30.86 | L1.1 58.42,35.61 58.42,30.48 | 58.42,30.48 57.72,29.78 57.72,27.88 59.21,29.36 C10.+ 62.38,29.36 | 62.23,29.21 62.6,29.58 63.5,30.48 68.58,30.48 v68.58,31.75 68.58,31.98 68.16,32.4 67.87,32.11 60.5,32.11 61.29,31.32 61.29,30.73
N$26  (via drill 0.5)
  Top 0.813: R23.1 13.97,39.94 v13.53,40.39
  Top 3: Q3.B 23.24,57.15 v26.67,57.15 26.67,59.69 24.13,59.69 25.4,58.42
  Bottom 0.813: v13.53,40.39 11.43,42.48 11.43,53.34 12.22,54.13 12.22,54.18 23.7,54.18 v26.67,57.15
N$27
  Top 0.406: R40.1 32.86,47.71 32.86,49.13
  Top 0.813: 32.86,49.13 OK1.1
N$28
  Top 0.305: 21.59,21.59 13.04,21.59 IC4.6
  Top 0.406: IC4.6 12.99,21.59 | R25.2 17.93,27.94 20.32,27.94 21.59,26.67 21.59,21.59
  Top 0.813: R24.2 11.48,30.35 C14.2 15.37,30.35 17.78,27.94 R25.2
N$29  (via drill 0.8 pad 2)
  other vias: 16.55,47.9
N$30
  Top 0.813: R43.1 5.08,6.18 | 5.08,6.18 5.08,4.88 | R26.1 5.08,6.92 5.08,6.18
  Top 3: R54.3 4.65,3.81 4.64,3.8 5.61,3.8 5.69,3.72 5.77,3.8 5.77,4.3 4.76,4.3 4.64,4.43 5.08,4.88 5.08,5.08
N$31  (3 unrouted)
  Top 0.406: R17.2 8.74,42.06 7.62,43.18 2.54,43.18 2.54,52.07 13.97,52.07 13.97,50.98 14.15,50.8
  Top 2: 14.73,50.47 14.61,50.34 14.02,50.34 13.81,50.13 T3.3 14.15,50.8 17.78,50.8 | 17.78,50.8 19.05,50.8 19.05,54.61 16.51,54.61 16.51,52.07 17.78,50.8 | 17.78,50.8 17.78,53.34
  Top 2.54: 16.51,55.88 Q3.C 17.78,59.18 18.45,61.06 18.54,56.11 16.51,55.88 | 16.51,55.88 16.52,61.06 17.93,61.19
N$32  (1 unrouted)
  Top 0.406: R27.1 20.84,43.02 22.1,44.27 22.1,51.97 22.23,52.09
  Top 0.813: OK1.3 22.23,52.09 21.88,52.09 21.56,52.41
N$33  (via drill 0.8 pad 2)
  Bottom 2: v16.55,50.44 16.55,50.8 19.05,50.8 18.89,51.37 16.54,51.42
N$34
  Bottom 0.61: LED2.K 57.15,1.27 56.95,1.07 51.77,1.07 | 51.77,1.07 52.07,1.37 LED1.A | 22.57,7.91 17.8,7.91 17.64,8.08 17.64,7.87 17.41,7.64 17.41,1.83 18.17,1.07 51.77,1.07 | 22.57,7.91 22.57,6.48 R55.2 | 22.57,7.91 25.69,7.91 26.67,8.89 R48.1
N$35  (1 unrouted)
  Top 0.813: R35.2 R46.2 31.75,2.54 29.13,2.54 R45.1
  Top 4: R53.3 33.02,3.81 33.02,2.76 34.29,2.76
N$36
  Top 0.406: R41.1 11.43,14.41 11.43,19.05 12.68,20.3 IC4.5
N$37
  Bottom 0.406: IC1.2 35.83,11.18 35.34,10.69 35.34,7.49 29.29,7.49 29.25,7.53
  Bottom 0.61: R58.2 24.87,6.24 29.25,6.24 29.25,7.1 | 29.25,7.1 29.25,7.53 29.25,10.54 R56.1 | 29.38,7.23 29.25,7.1
N$38
  Top 0.406: U1.3 32.31,27.23 30.58,25.5 R36.2
N$39
  Top 0.406: R18.2 36.97,41.77 36.83,41.91 37.07,42.15 X1.4
  Top 0.813: 38.1,41.91 36.97,40.78 R18.2
N$40
  Top 0.406: R12.2 37.69,47.23 X1.3
N$41
  Top 0.406: R27.2 18.67,45.53
  Top 1.27: T3.1 14.78,45.57 14.99,45.36 18.5,45.36 18.67,45.53 18.89,45.75 D7.A
N$42  (1 unrouted)
  Top 0.813: R52.2 R39.1 15.66,5.5 15.24,5.08
  Top 2.54: R54.1 15.24,3.81
  Top 3: R54.1 16.14,3.81 16.22,3.89 16.22,4.22 14.77,4.22 14.72,4.27 14.63,4.18 14.63,3.85
N$43
  Top 0.406: 13.36,24.11 IC4.8 12.84,24.27 12.84,26.34 R19.2
  Top 0.61: IC4.8 15.38,24.11 C8.1 17.73,22.99 18.87,24.13 17.77,24.13 16.51,24.13 16.5,24.13
  Top 0.813: C8.1 16.5,24.13 | 17.77,24.13 17.77,25.23 18.87,24.13 R37.1
  Top 1.27: R25.1 17.77,25.23
N$44
  Top 0.406: R40.2 34.37,45.94 34.61,46.18 34.61,47.52 36.64,49.55 36.78,49.55 38.1,50.88 38.1,52.2 X1.2
N$45
  Top 0.813: R13.2 44.18,4.08 44.37,3.89 R53.1 44.37,3.73 42.76,2.12 R9.1
  Top 4: R53.1 44.45,3.73 | 44.45,3.73 44.45,2.76 45.72,2.76 | 44.45,3.73 45.64,3.73 45.72,3.81
N$46
  Top 1.27: R49.2 43.79,31.85 43.78,31.86 46.34,31.86 46.42,31.79 46.42,29.55 46.34,29.48 45.52,29.48 44.79,30.2 44.93,30.34 45.76,30.34 45.76,30.96 45.66,31.06 45.59,31 44.35,31 44.35,30.58 44.45,30.48
  Top 1.5: R49.2 45.95,29.11
  Top 1.8: R50.1 45.95,29.11 45.9,29.16
N$47
  Top 0.406: IC2.5 IC2.6
N$48
  Bottom 0.61: IC1.3 R57.2
N$49  (1 unrouted)
N$50  (via drill 0.5)
  other vias: 71.12,31.75
N$51  (via drill 0.5)
  other vias: 68.58,21.59
N$52
  Top 1.27: 46.06,24.18 46.3,23.93 46.3,23.37 44.76,23.37 44.72,23.41 44.84,23.53 R7.1 44.84,25.05 44.76,25.13 44.76,25.72 44.79,25.76 44.83,25.72 45.19,25.72
  Top 1.8: 46.06,24.18 46.06,25.53 R50.2
N$53  (via drill 0.5)
  other vias: 73.66,21.59
N$54  (via drill 0.8 pad 2)
  other vias: 66.04,55.88
N$55  (via drill 0.8 pad 2)
  other vias: 66.04,53.34
N$56  (via drill 0.8 pad 2)
  other vias: 66.04,50.8
N$57  (via drill 0.8 pad 2)
  other vias: 66.04,45.72
N$58  (via drill 0.8 pad 2)
  other vias: 66.04,43.18
N$59  (via drill 0.8 pad 2)
  other vias: 66.04,40.64
N$61
  Top 0.813: OK4.3 56.97,43.18 R33.1 57.27,45.26 R38.1
N$62
  Top 0.813: R29.2 44.76,48.37 OK4.1
N$63
  Top 0.406: R28.2 41.11,57.68 | 41.11,57.68 38.28,57.68 X1.1 | 42.33,50.38 42.33,53.82 41.11,55.04 41.11,57.68
  Top 0.813: R29.1 42.33,50.38
N$64
  Top 0.813: R28.1 44.83,55.88 OK2.1
N$65
  Top 0.406: C17.2 13.76,12.7 8.89,12.7 | 8.89,12.7 8.89,9.03 R26.2 | R22.2 8.89,15.48 8.89,12.7
  Top 0.813: U4.1 U4.2 13.49,14.2 C17.2
N$66
  Top 1.016: R8.1 73.99,14.03 R5.1
  Top 1.27: 74.04,12.06 R5.1
N$106  (2 unrouted)
  Top 0.406: R24.1 10.32,35.73 11.43,36.83 11.43,40.64 7.25,40.64 5.96,41.94 1.51,41.94 1.51,52.07 1.51,52.31 1.51,53.61 2.86,54.95
  Top 2.54: Q3.E 11.96,61.11 10.07,60.98 9.46,60.94 9.28,58.34 11.34,58.34 11.16,59.78 | 2.86,54.95 4.92,54.95 | R42.2 8.89,59.69 10.16,59.69
N$289
  Top 0.406: 13.97,22.86 13.04,22.86 IC4.7 11.24,22.84 11.05,23.02 11.05,29.21 8.89,29.21 7.62,30.48 7.62,32.94 13.76,32.94 C14.1
  Top 0.813: R23.2 C14.1
N$290  (1 unrouted)
  Top 0.813: R52.1 11.43,7.2 | 11.43,7.2 11.43,5.08 | C6.2 11.43,10.16 11.14,10.45 R41.2 11.43,10.99 11.43,7.2
  Top 3: R54.2 10.77,3.81 10.78,3.8 9.56,3.8 9.49,3.72 | 9.45,3.68 9.49,3.72 | 9.49,3.72 9.49,4.3 10.67,4.3
N$291
  Top 0.406: IC4.1 7.83,24.09 9.92,24.09 9.92,18.29 R22.1
N$292
  Top 0.406: IC4.3 6.86,21.57 | 5.23,31.9 R21.2 5.23,31.17 3.81,29.74 3.81,29.21 | 3.83,29.18 3.81,29.21 | 6.35,21.57 6.04,21.87 5.95,21.87 3.81,24.01 3.81,29.21
  Top 0.61: IC4.3 6.35,21.57
  Top 0.813: R17.1 9.16,38.95 9.16,37.08 5.23,33.16 R21.2
N$294
  Top 0.406: 7.84,22.86 IC4.2 6.35,22.84 5.23,23.95 5.23,25.4 | R19.1 8.94,26.72 8.89,26.67
  Top 0.813: R19.1 8.39,27.94 R20.2 5.23,25.4
OUT+  (via drill 0.5, 0.5 pad 1.3, 0.5 pad 1.5, 1 pad 2.5, 1.2 pad 2)  (4 unrouted)
  Top 0.406: C20.1 27.31,44.15 26.6,43.44
  Top 0.813: D6.C 61.17,52.37 R3.2 | X5.2 21.59,38.43 26.6,43.44 v26.9,43.44 26.9,45.51 C20.1
  Top 1.27: 62.7,51.1 62.7,50.8 T2.3 | 35.85,35.84 36.04,36.03 40.2,36.03 | 40.84,34.17 40.84,35.39 40.2,36.03 | 40.2,36.03 41.82,36.03 42.04,36.25 | T3.2 v16.76,47.85 16.79,47.88
  Top 2: v49.53,41.91 v49.53,39.37
  Top 2.54: v35.27,35.67 36.65,34.29 38.1,34.29 | R51.2 20.32,14.11 20.32,17.78 24.13,17.78 v24.13,15.24 | v24.13,15.24 24.13,13.97 22.86,13.97 21.59,12.7 21.59,16.51 v24.13,15.24 | 51.26,49.34 62.04,49.34 62.23,49.53 69.85,49.53 | JP1.1 77.93,13.13 v78.4,13.6
  Top 3: X2.1 40.84,34.17 43.54,36.87 46.6,36.87 49.75,40.02 50.2,40.02 50.2,48.28 51.26,49.34 51.26,49.25
  Bottom 1.27: v35.27,35.67 36.83,34.29 39.37,34.29 | v49.53,41.91 v49.53,43.18
  Bottom 2: v49.53,39.37 49.53,40.64 | 41.03,35.44 39.37,35.44 X2.1 40.52,34.17 40.64,34.29 | 22.5,47.78 22.04,47.78 21.98,47.83 16.79,47.83 v16.76,47.85
  Bottom 2.54: 36.83,34.29 36.09,35.03 35.22,35.03 33.26,36.98 33.26,39.15 33.1,39.15 31.79,40.46 29.88,40.46 v26.9,43.44 22.56,47.78 22.5,47.78 | 41.03,35.44 41,35.47 41,35.55 35.4,35.55 v35.27,35.67
  Bottom 3: v24.13,15.24 24.13,17.78 | 24.13,17.78 20.32,17.78 20.32,15.24 21.59,12.7 v24.13,15.24 | v24.13,15.24 21.59,15.24 24.13,17.78 | 24.13,17.78 35.56,15.24 46.99,15.24 52.07,10.16 73.95,10.16 75.77,11.98 77.93,11.98 | v49.53,39.37 60.96,39.37 64.77,35.56 78.69,35.56 78.69,7.62 76.2,7.62 76.2,10.16 77.47,10.16
  other vias: 40.64,35.56
  pour Top (isolate 1.93, no thermals): 17.78,22.86 27.94,22.86 27.94,10.16 17.78,10.16
  pour Bottom (isolate 1.93): 16.51,0 16.51,21.59 31.75,21.59 34.29,19.05 49.53,19.05 57.15,11.43 73.66,11.43 77.47,15.24 77.47,34.29 64.77,34.29 60.96,38.1 48.26,38.1 48.26,44.45 80.01,44.45 80.01,0
V+  (via drill 0.5)  (1 unrouted)
  Top 0.406: v53.34,59.69 51.71,61.32 36.28,61.32 27.94,52.97 27.94,49.52 OK1.4 23.74,45.72 | 23.74,45.72 23.74,42.62 19.05,37.93 19.05,37.31 | C20.2 24.32,45.72 23.74,45.72
  Top 0.813: v55.88,46.99 54.61,45.72 OK4.4 | v53.34,59.69 55.88,59.69 55.88,55.88 | OK1.4 24.08,49.55 | 19.05,37.31 X5.1
  Bottom 0.813: v53.34,59.69 55.88,57.15 v55.88,46.99
(copper drawn outside any net)
  shapes: Top circle x3

### Text on the board
Top: VasylD 11.11.2018 | Rev 1 | 1 | 1
Bottom: VasylD 11.11.2018 | PS + Load Rev0 | 8 | 4
bPlace: Gate | OUT / ON/OFF | Base | Load ON/OFF | ADC I2 | Gate | Gate | ADC I1 | OUT+ | +15V | -15V | +12V | +12V | GND | + | + | OUT- | LM258 | GND | IN- | OUT- | LM258 | IN+ | OUT+ | + | TPS54340 | LED I | LED U | A | A